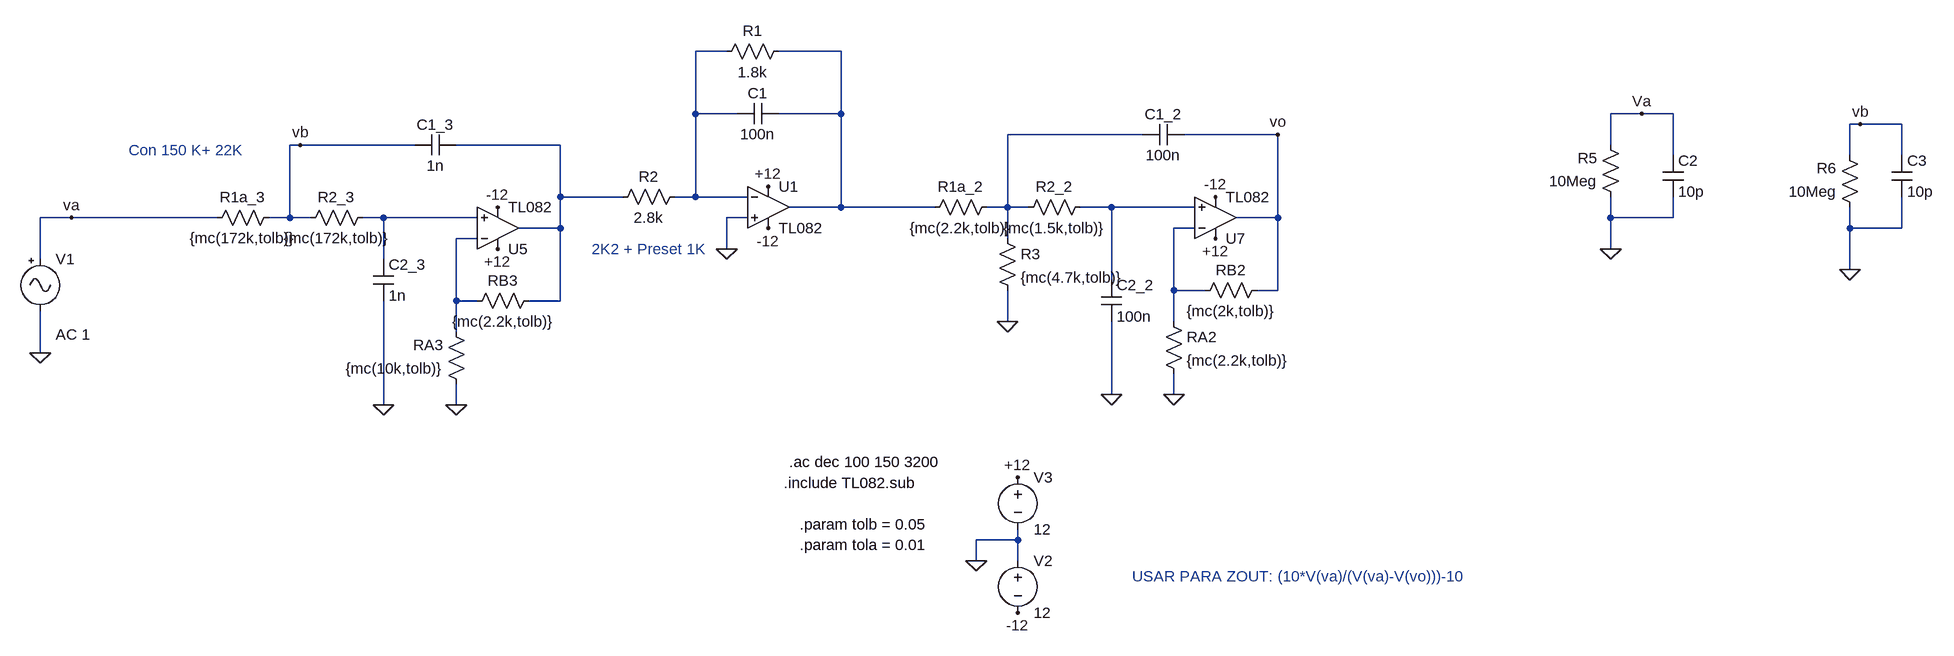
[diagram p0: schematic FiltroLP_ConRetardo.asc]
FiltroLP_ConRetardo.asc, the LTspice schematic file:
Version 4
SHEET 1 2408 868
WIRE 80 -160 32 -160
WIRE 256 -160 160 -160
WIRE 32 -64 32 -160
WIRE 96 -64 32 -64
WIRE 256 -64 256 -160
WIRE 256 -64 160 -64
WIRE 1488 -64 1440 -64
WIRE 1536 -64 1488 -64
WIRE 1824 -48 1808 -48
WIRE 1888 -48 1824 -48
WIRE 720 -32 512 -32
WIRE 928 -32 784 -32
WIRE -576 -16 -592 -16
WIRE -400 -16 -576 -16
WIRE -176 -16 -336 -16
WIRE 1440 -16 1440 -64
WIRE 1536 0 1536 -64
WIRE 1808 0 1808 -48
WIRE 1888 0 1888 -48
WIRE -176 64 -176 -16
WIRE -80 64 -176 64
WIRE 32 64 32 -64
WIRE 32 64 0 64
WIRE 112 64 32 64
WIRE 256 80 256 -64
WIRE 256 80 176 80
WIRE 400 80 256 80
WIRE 512 80 512 -32
WIRE 512 80 480 80
WIRE 544 80 512 80
WIRE 672 80 624 80
WIRE 800 80 672 80
WIRE -928 96 -976 96
WIRE -704 96 -928 96
WIRE -592 96 -592 -16
WIRE -592 96 -624 96
WIRE -560 96 -592 96
WIRE -448 96 -480 96
WIRE -304 96 -448 96
WIRE 112 96 80 96
WIRE 928 96 928 -32
WIRE 928 96 864 96
WIRE 1440 96 1440 64
WIRE 1536 96 1536 64
WIRE 1536 96 1440 96
WIRE -176 112 -176 64
WIRE -176 112 -240 112
WIRE 800 112 768 112
WIRE 1808 112 1808 80
WIRE 1888 112 1888 64
WIRE 1888 112 1808 112
WIRE -304 128 -336 128
WIRE 512 128 512 80
WIRE 80 144 80 96
WIRE 1440 144 1440 96
WIRE -976 160 -976 96
WIRE -448 160 -448 96
WIRE 1808 176 1808 112
WIRE 672 192 672 80
WIRE 768 208 768 112
WIRE 816 208 768 208
WIRE 928 208 928 96
WIRE 928 208 896 208
WIRE -336 224 -336 128
WIRE -304 224 -336 224
WIRE -176 224 -176 112
WIRE -176 224 -224 224
WIRE 512 256 512 208
WIRE 768 256 768 208
WIRE -336 272 -336 224
WIRE -976 304 -976 240
WIRE 672 368 672 256
WIRE 768 368 768 336
WIRE -448 384 -448 224
WIRE -336 384 -336 352
WIRE 528 592 528 576
WIRE 528 592 464 592
WIRE 464 624 464 592
WIRE 528 624 528 592
FLAG 768 368 0
FLAG 672 368 0
FLAG -976 304 0
FLAG -336 384 0
FLAG -448 384 0
FLAG 464 624 0
FLAG 528 496 +12
FLAG 832 128 +12
FLAG -272 144 +12
FLAG 528 704 -12
FLAG 832 64 -12
FLAG -272 80 -12
FLAG 144 48 +12
FLAG 144 112 -12
FLAG 80 144 0
FLAG 512 256 0
FLAG 928 -32 vo
FLAG 1440 144 0
FLAG 1808 176 0
FLAG 1488 -64 Va
FLAG -928 96 va
FLAG 1824 -48 vb
FLAG -576 -16 vb
SYMBOL res 912 192 R90
WINDOW 0 0 56 VBottom 2
WINDOW 3 32 56 VTop 2
SYMATTR InstName RB2
SYMATTR Value {mc(2k,tolb)}
SYMBOL res 752 240 R0
SYMATTR InstName RA2
SYMATTR Value {mc(2.2k,tolb)}
SYMBOL res 640 64 R90
WINDOW 0 0 56 VBottom 2
WINDOW 3 32 56 VTop 2
SYMATTR InstName R2_2
SYMATTR Value {mc(1.5k,tolb)}
SYMBOL res 496 64 R90
WINDOW 0 0 56 VBottom 2
WINDOW 3 32 56 VTop 2
SYMATTR InstName R1a_2
SYMATTR Value {mc(2.2k,tolb)}
SYMBOL cap 656 192 R0
SYMATTR InstName C2_2
SYMATTR Value 100n
SYMBOL cap 784 -48 R90
WINDOW 0 0 32 VBottom 2
WINDOW 3 32 32 VTop 2
SYMATTR InstName C1_2
SYMATTR Value 100n
SYMBOL Misc\\signal -976 144 R0
WINDOW 123 24 132 Left 2
WINDOW 39 0 0 Left 2
SYMATTR Value2 AC 1
SYMATTR InstName V1
SYMATTR Value ""
SYMBOL res -608 80 R90
WINDOW 0 0 56 VBottom 2
WINDOW 3 32 56 VTop 2
SYMATTR InstName R1a_3
SYMATTR Value {mc(172k,tolb)}
SYMBOL res -464 80 R90
WINDOW 0 0 56 VBottom 2
WINDOW 3 32 56 VTop 2
SYMATTR InstName R2_3
SYMATTR Value {mc(172k,tolb)}
SYMBOL cap -464 160 R0
SYMATTR InstName C2_3
SYMATTR Value 1n
SYMBOL res -208 208 R90
WINDOW 0 0 56 VBottom 2
WINDOW 3 32 56 VTop 2
SYMATTR InstName RB3
SYMATTR Value {mc(2.2k,tolb)}
SYMBOL res -320 368 R180
WINDOW 0 36 76 Left 2
WINDOW 3 36 40 Left 2
SYMATTR InstName RA3
SYMATTR Value {mc(10k,tolb)}
SYMBOL cap -336 -32 R90
WINDOW 0 0 32 VBottom 2
WINDOW 3 32 32 VTop 2
SYMATTR InstName C1_3
SYMATTR Value 1n
SYMBOL Opamps\\opamp2 -272 176 M180
SYMATTR InstName U5
SYMATTR Value TL082
SYMBOL Opamps\\opamp2 832 160 M180
SYMATTR InstName U7
SYMATTR Value TL082
SYMBOL voltage 528 608 R0
WINDOW 123 0 0 Left 2
WINDOW 39 0 0 Left 2
SYMATTR InstName V2
SYMATTR Value 12
SYMBOL voltage 528 480 R0
WINDOW 123 0 0 Left 2
WINDOW 39 0 0 Left 2
SYMATTR InstName V3
SYMATTR Value 12
SYMBOL Opamps\\opamp2 144 16 R0
SYMATTR InstName U1
SYMATTR Value TL082
SYMBOL cap 160 -80 R90
WINDOW 0 0 32 VBottom 2
WINDOW 3 32 32 VTop 2
SYMATTR InstName C1
SYMATTR Value 100n
SYMBOL res 176 -176 R90
WINDOW 0 0 56 VBottom 2
WINDOW 3 32 56 VTop 2
SYMATTR InstName R1
SYMATTR Value 1.8k
SYMBOL res 16 48 R90
WINDOW 0 0 56 VBottom 2
WINDOW 3 32 56 VTop 2
SYMATTR InstName R2
SYMATTR Value 2.8k
SYMBOL res 496 112 R0
SYMATTR InstName R3
SYMATTR Value {mc(4.7k,tolb)}
SYMBOL res 1456 80 R180
WINDOW 0 36 76 Left 2
WINDOW 3 36 40 Left 2
SYMATTR InstName R5
SYMATTR Value 10Meg
SYMBOL res 1824 96 R180
WINDOW 0 36 76 Left 2
WINDOW 3 36 40 Left 2
SYMATTR InstName R6
SYMATTR Value 10Meg
SYMBOL cap 1520 0 R0
SYMATTR InstName C2
SYMATTR Value 10p
SYMBOL cap 1872 0 R0
SYMATTR InstName C3
SYMATTR Value 10p
TEXT 176 472 Left 2 !.ac dec 100 150 3200
TEXT 168 504 Left 2 !.include TL082.sub
TEXT 192 568 Left 2 !.param tolb = 0.05
TEXT 192 600 Left 2 !.param tola = 0.01
TEXT -128 144 Left 2 ;2K2 + Preset 1K
TEXT -840 -8 Left 2 ;Con 150 K+ 22K
TEXT 704 648 Left 2 ;USAR PARA ZOUT: (10*V(va)/(V(va)-V(vo)))-10

The netlist it stands for:
* FiltroLP_ConRetardo.asc
RB2 vo N007 {mc(2k,tolb)}
RA2 N007 0 {mc(2.2k,tolb)}
R2_2 N005 N003 {mc(1.5k,tolb)}
R1a_2 N003 N002 {mc(2.2k,tolb)}
C2_2 N005 0 100n
C1_2 vo N003 100n
V1 Va 0 AC 1
R1a_3 vb Va {mc(172k,tolb)}
R2_3 N006 vb {mc(172k,tolb)}
C2_3 N006 0 1n
RB3 N004 N008 {mc(2.2k,tolb)}
RA3 0 N008 {mc(10k,tolb)}
C1_3 N004 vb 1n
XU5 N006 N008 +12 -12 N004 TL082  ; pins In+ In- V+ V- OUT
XU7 N005 N007 +12 -12 vo TL082  ; pins In+ In- V+ V- OUT
V2 0 -12 12
V3 +12 0 12
XU1 0 N001 +12 -12 N002 TL082  ; pins In+ In- V+ V- OUT
C1 N002 N001 100n
R1 N002 N001 1.8k
R2 N001 N004 2.8k
R3 N003 0 {mc(4.7k,tolb)}
R5 0 Va 10Meg
R6 0 vb 10Meg
C2 Va 0 10p
C3 vb 0 10p
.ac dec 100 150 3200
.include TL082.sub
.param tolb = 0.05
.param tola = 0.01
* 2K2 + Preset 1K
* Con 150 K+ 22K
* USAR PARA ZOUT: (10*V(va)/(V(va)-V(vo)))-10
.backanno
.end